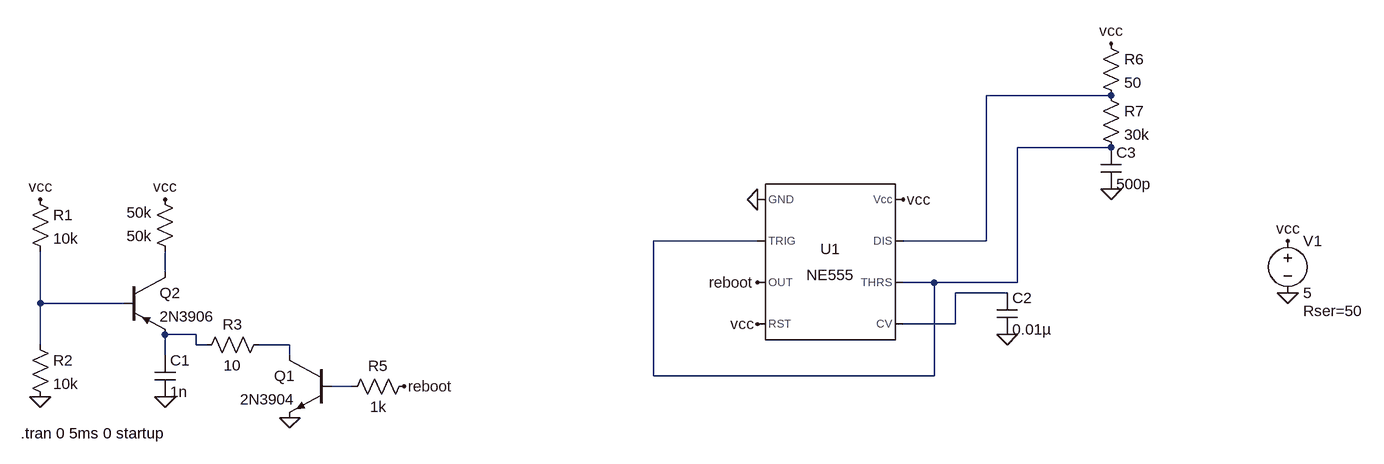
[diagram p0: schematic rampa555.asc]
rampa555.asc, the LTspice schematic file:
Version 4
SHEET 1 2016 680
WIRE 1616 -224 1424 -224
WIRE 1616 -144 1472 -144
WIRE 1072 0 912 0
WIRE 1424 0 1424 -224
WIRE 1424 0 1296 0
WIRE 160 48 160 16
WIRE 1344 64 1296 64
WIRE 1472 64 1472 -144
WIRE 1472 64 1344 64
WIRE 1456 80 1376 80
WIRE -32 96 -32 16
WIRE 96 96 -32 96
WIRE 1376 128 1376 80
WIRE 1376 128 1296 128
WIRE 208 144 160 144
WIRE -32 160 -32 96
WIRE 208 160 208 144
WIRE 224 160 208 160
WIRE 352 160 304 160
WIRE 160 176 160 144
WIRE 352 176 352 160
WIRE 912 208 912 0
WIRE 1344 208 1344 64
WIRE 1344 208 912 208
WIRE 448 224 416 224
FLAG -32 -64 vcc
FLAG 160 -64 vcc
FLAG -32 240 0
FLAG 160 240 0
FLAG 352 272 0
FLAG 1072 -64 0
FLAG 1296 -64 vcc
FLAG 1072 64 reboot
FLAG 528 224 reboot
FLAG 1072 128 vcc
FLAG 1456 144 0
FLAG 1616 -80 0
FLAG 1616 -304 vcc
FLAG 1888 80 0
FLAG 1888 0 vcc
SYMBOL res -48 -80 R0
SYMATTR InstName R1
SYMATTR Value 10k
SYMBOL res -48 144 R0
SYMATTR InstName R2
SYMATTR Value 10k
SYMBOL res 320 144 R90
WINDOW 0 0 56 VBottom 2
WINDOW 3 32 56 VTop 2
SYMATTR InstName R3
SYMATTR Value 10
SYMBOL res 176 32 R180
WINDOW 0 36 76 Left 2
WINDOW 3 36 40 Left 2
SYMATTR InstName 50k
SYMATTR Value 50k
SYMBOL res 432 240 R270
WINDOW 0 32 56 VTop 2
WINDOW 3 0 56 VBottom 2
SYMATTR InstName R5
SYMATTR Value 1k
SYMBOL cap 144 176 R0
SYMATTR InstName C1
SYMATTR Value 1n
SYMBOL npn 416 176 M0
SYMATTR InstName Q1
SYMATTR Value 2N3904
SYMBOL pnp 96 48 R0
SYMATTR InstName Q2
SYMATTR Value 2N3906
SYMBOL Misc\\NE555 1184 32 R0
SYMATTR InstName U1
SYMBOL cap 1440 80 R0
SYMATTR InstName C2
SYMATTR Value 0.01µ
SYMBOL res 1600 -320 R0
SYMATTR InstName R6
SYMATTR Value 50
SYMBOL res 1600 -240 R0
SYMATTR InstName R7
SYMATTR Value 30k
SYMBOL cap 1600 -144 R0
SYMATTR InstName C3
SYMATTR Value 500p
SYMBOL voltage 1888 -16 R0
WINDOW 123 0 0 Left 0
WINDOW 39 24 124 Left 2
SYMATTR InstName V1
SYMATTR Value 5
SYMATTR SpiceLine Rser=50
TEXT -62 296 Left 2 !.tran 0 5ms 0 startup

The netlist it stands for:
* rampa555.asc
R1 vcc N005 10k
R2 N005 0 10k
R3 N007 N006 10
R§50k N003 vcc 50k
R5 N008 reboot 1k
C1 N006 0 1n
Q1 N007 N008 0 0 2N3904
Q2 N003 N005 N006 0 2N3906
XU1 0 N002 reboot vcc N004 N002 N001 vcc NE555  ; pins GND TRIG OUT RST CV THRS DIS Vcc
C2 N004 0 0.01µ
R6 vcc N001 50
R7 N001 N002 30k
C3 N002 0 500p
V1 vcc 0 5 Rser=50
.model NPN NPN
.model PNP PNP
.lib standard.bjt
.tran 0 5ms 0 startup
.lib NE555.sub
.backanno
.end